# Altium project MSB-PCB-1R2.PrjPcb
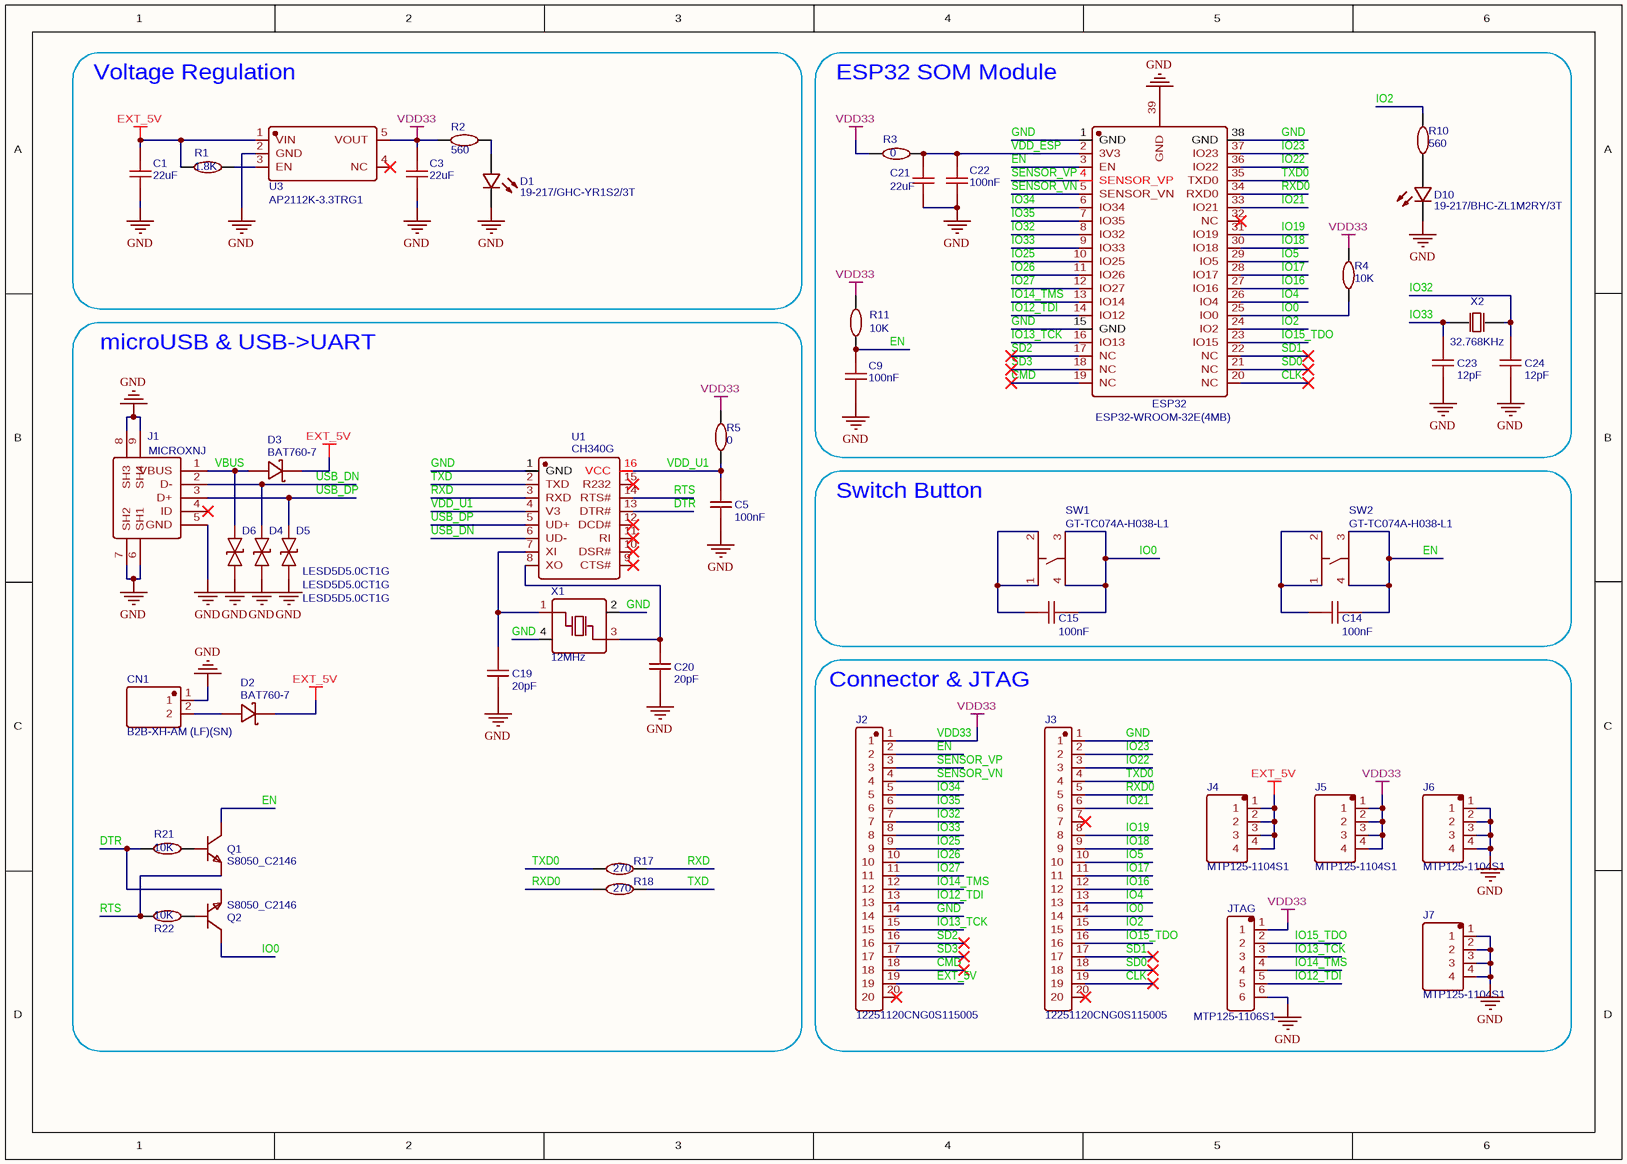
[diagram p0: MSB-PCB-1R2.schdoc]
PRJ_AssemblyVariantStatus: Prototype; PRJ_CompanySiteName: MakerSpace Bonn e.V.; PRJ_DeveloperDate: 15.06.2021; PRJ_DeveloperName: NEK; PRJ_Layouter: NEK; PRJ_PcbNumber: 01; PRJ_PcbVersion: 01; PRJ_SchematicMainTitle: 1rpc ESP32 Baseboard
1 sheet, 48 parts. Net scope: global (net labels, ports and power ports of the same name join across sheets).
Board file: MSB-PCB-1R2.PcbDoc

## Sheet MSB-PCB-1R2.schdoc
size 304 x 217 mm

### Parts
C1  22uF  [C0603]
C3  22uF  [C0603]
C5  100nF  [C0603]
C9  100nF  [C0603]
C14  100nF  [C0603]
C15  100nF  [C0603]
C19  20pF  [C0603]
C20  20pF  [C0603]
C21  22uF  [C0603]
C22  100nF  [C0603]
C23  12pF  [C0603]
C24  12pF  [C0603]
CN1  B2B-XH-AM (LF)(SN)  [CONN-TH_B2B-XH-AM-LF-SN]
D1  19-217/GHC-YR1S2/3T  [LED0603-R-RD]
D2  BAT760-7  [SOD-323_L1.8-W1.3-LS2.5-RD]
D3  BAT760-7  [SOD-323_L1.8-W1.3-LS2.5-RD]
D4  LESD5D5.0CT1G  [SOD-523_L1.2-W0.8-LS1.6-BI]
D5  LESD5D5.0CT1G  [SOD-523_L1.2-W0.8-LS1.6-BI]
D6  LESD5D5.0CT1G  [SOD-523_L1.2-W0.8-LS1.6-BI]
D10  19-217/BHC-ZL1M2RY/3T  [LED0603-R-RD]
ESP32  ESP32-WROOM-32E(4MB)  [WIFI-SMD_ESP32-WROOM-32E]
J1  MICROXNJ  [MICRO-USB-SMD_MICROXNJ]
J2  12251120CNG0S115005  [HDR-TH_19P-P2.54-V]
J3  12251120CNG0S115005  [HDR-TH_19P-P2.54-V]
J4  MTP125-1104S1  [HDR-TH_4P-P2.54-V]
J5  MTP125-1104S1  [HDR-TH_4P-P2.54-V]
J6  MTP125-1104S1  [HDR-TH_4P-P2.54-V]
J7  MTP125-1104S1  [HDR-TH_4P-P2.54-V]
JTAG  MTP125-1106S1  [HDR-TH_6P-P2.54-V]
Q1  S8050_C2146  [SOT-23-3_L3.0-W1.7-P0.95-LS2.9-BR]
Q2  S8050_C2146  [SOT-23-3_L3.0-W1.7-P0.95-LS2.9-BR]
R1  1.8K  [R0603]
R2  560  [R0603]
R3  0  [R0603]
R4  10K  [R0603]
R5  0  [R0603]
R10  560  [R0603]
R11  10K  [R0603]
R17  270  [R0603]
R18  270  [R0603]
R21  10K  [R0603]
R22  10K  [R0603]
SW1  GT-TC074A-H038-L1  [SW-SMD_4P-L4.5-W4.5-P3.00-LS7.0]
SW2  GT-TC074A-H038-L1  [SW-SMD_4P-L4.5-W4.5-P3.00-LS7.0]
U1  CH340G  [SOIC-16_L9.9-W3.9-P1.27-LS6.0-TL]
U3  AP2112K-3.3TRG1  [SOT-25-5_L3.0-W1.8-P0.95-LS3.0-BR]
X1  12MHz  [OSC-SMD_4P-L3.2-W2.5-BL]
X2  32.768KHz  [OSC-SMD_L3.2-W1.5]

### Blocks framed on the sheet
Voltage Regulation: C1 C3 D1 R1 R2 U3
ESP32 SOM Module: C9 C21-C24 D10 ESP32 R3 R4 R10 R11 X2
microUSB & USB->UART: C5 C19 C20 CN1 D2-D6 J1 Q1 Q2 R5 R17 R18 R21 R22 U1 X1
Switch Button: C14 C15 SW1 SW2
Connector & JTAG: J2-J7 JTAG

### Nets
EXT_5V: C1.2 D2.1 D3.1 J2.19 J4.1 J4.2 J4.3 J4.4 R1.1 U3.1(VIN)
GND: C1.1 C3.1 C5.2 C9.1 C19.1 C20.1 C21.1 C22.1 C23.1 C24.1 CN1.1 D1.2(C) D4.1 D5.1 D6.1 D10.2(C) ESP32.1(GND) ESP32.15(GND) ESP32.38(GND) ESP32.39(GND) J1.5(GND) J1.6(SH1) J1.7(SH2) J1.8(SH3) J1.9(SH4) J2.14 J3.1 J6.1 J6.2 J6.3 J6.4 J7.1 J7.2 J7.3 J7.4 JTAG.6 U1.1(GND) U3.2(GND) X1.2(GND) X1.4(GND)
VDD33: C3.2 J2.1 J5.1 J5.2 J5.3 J5.4 JTAG.1 R2.2 R3.1 R4.2 R5.2 R11.2 U3.5(VOUT)
CLK: ESP32.20(NC) J3.19
CMD: ESP32.19(NC) J2.18
DTR: Q2.2(E) R21.1 U1.13(DTR#)
EN: C9.2 C14.2 ESP32.3(EN) J2.2 Q1.3(C) R11.1 SW2.3 SW2.4
IO0: C15.2 ESP32.25(IO0) J3.14 Q2.3(C) R4.1 SW1.3 SW1.4
IO2: ESP32.24(IO2) J3.15 R10.2
IO4: ESP32.26(IO4) J3.13
IO5: ESP32.29(IO5) J3.10
IO12_TDI: ESP32.14(IO12) J2.13 JTAG.5
IO13_TCK: ESP32.16(IO13) J2.15 JTAG.3
IO14_TMS: ESP32.13(IO14) J2.12 JTAG.4
IO15_TDO: ESP32.23(IO15) J3.16 JTAG.2
IO16: ESP32.27(IO16) J3.12
IO17: ESP32.28(IO17) J3.11
IO18: ESP32.30(IO18) J3.9
IO19: ESP32.31(IO19) J3.8
IO21: ESP32.33(IO21) J3.6
IO22: ESP32.36(IO22) J3.3
IO23: ESP32.37(IO23) J3.2
IO25: ESP32.10(IO25) J2.9
IO26: ESP32.11(IO26) J2.10
IO27: ESP32.12(IO27) J2.11
IO32: C24.2 ESP32.8(IO32) J2.7 X2.2(OSC2)
IO33: C23.2 ESP32.9(IO33) J2.8 X2.1(OSC1)
IO34: ESP32.6(IO34) J2.5
IO35: ESP32.7(IO35) J2.6
RTS: Q1.2(E) R22.1 U1.14(RTS#)
RXD: R17.2 U1.3(RXD)
RXD0: ESP32.34(RXD0) J3.5 R18.1
SD0: ESP32.21(NC) J3.18
SD1: ESP32.22(NC) J3.17
SD2: ESP32.17(NC) J2.16
SD3: ESP32.18(NC) J2.17
SENSOR_VN: ESP32.5(SENSOR_VN) J2.4
SENSOR_VP: ESP32.4(SENSOR_VP) J2.3
TXD: R18.2 U1.2(TXD)
TXD0: ESP32.35(TXD0) J3.4 R17.1
USB_DN: D4.2 J1.2(D-) U1.6(UD-)
USB_DP: D5.2 J1.3(D+) U1.5(UD+)
VBUS: D3.2 D6.2 J1.1(VBUS)
VDD_ESP: C21.2 C22.2 ESP32.2(3V3) R3.2
VDD_U1: C5.1 R5.1 U1.4(V3) U1.16(VCC)
NetC14_1: C14.1 SW2.1 SW2.2
NetC15_1: C15.1 SW1.1 SW1.2
NetC19_2: C19.2 U1.7(XI) X1.1(OSC1)
NetC20_2: C20.2 U1.8(XO) X1.3(OSC2)
NetCN1_2: CN1.2 D2.2
NetD1_1: D1.1(A) R2.1
NetD10_1: D10.1(A) R10.1
NetQ1_1: Q1.1(B) R21.2
NetQ2_1: Q2.1(B) R22.2
NetR1_2: R1.2 U3.3(EN)

Not connected (* = marked no-connect by the designer): ESP32 32(NC)*; J1 4(ID)*; J2 20*; J3 7* 20*; U1 9(CTS#)* 10(DSR#)* 11(RI)* 12(DCD#)* 15(R232)*; U3 4(NC)*

### Library data of the parts
C1 C3 C21 = 22uF: BOM_Manufacturer: Murata Electronics; BOM_Manufacturer Part: GRM188R61A226ME15L; nameAlias: Capacitance; Contributor: LCSC; BOM_Supplier: LCSC; BOM_Supplier Part: C167429; BOM_JLCPCB Part Class: Extended Part; spicePre: C; spiceSymbolName: GRM188R61A226ME15L
C5 C9 C14 C15 C22 = 100nF: BOM_Manufacturer: YAGEO; BOM_Manufacturer Part: CC0603KRX7R9BB104; nameAlias: Capacitance; SMT Type: Basic; BOM_Supplier: LCSC; BOM_Supplier Part: C14663; BOM_JLCPCB SMD: Yes; BOM_LCSC Assembly: Yes; spicePre: C; spiceSymbolName: CC0603KRX7R9BB104
C19 C20 = 20pF: BOM_Manufacturer: CCTC; BOM_Manufacturer Part: TCC0603COG200J500CT; nameAlias: Capacitance; Contributor: LCSC; BOM_Supplier: LCSC; BOM_Supplier Part: C376774; spicePre: C; spiceSymbolName: TCC0603COG200J500CT
C23 C24 = 12pF: BOM_Manufacturer: CCTC; BOM_Manufacturer Part: TCC0603COG120J500CT; nameAlias: Capacitance; Contributor: LCSC; BOM_Supplier: LCSC; BOM_Supplier Part: C376767; spicePre: C; spiceSymbolName: TCC0603COG120J500CT
CN1 = B2B-XH-AM (LF)(SN): BOM_Manufacturer: JST Sales America; Contributor: LCSC; BOM_Supplier: LCSC; BOM_Supplier Part: C161869; BOM_Manufacturer Part: -; BOM_JLCPCB Part Class: Extended Part; spicePre: C; spiceSymbolName: B2B-XH-AM (LF)(SN)
D1 = 19-217/GHC-YR1S2/3T: BOM_Manufacturer: EVERLIGHT; BOM_Supplier: LCSC; BOM_Manufacturer Part: 19-217/GHC-YR1S2/3T; BOM_Supplier Part: C72043; BOM_JLCPCB Part Class: Basic Part; spicePre: L; spiceSymbolName: 19-217/GHC-YR1S2/3T
D2 D3 = BAT760-7: BOM_Manufacturer: DIODES; Contributor: LCSC; BOM_Supplier: LCSC; BOM_Manufacturer Part: BAT760-7; BOM_Supplier Part: C124187; BOM_JLCPCB Part Class: Extended Part; spicePre: D; spiceSymbolName: BAT760-7
D4-D6 = LESD5D5.0CT1G: BOM_Manufacturer: Leshan Radio; Contributor: LCSC; BOM_Supplier: LCSC; BOM_Supplier Part: C383211; BOM_Manufacturer Part: LESD5D5.0CT1G; BOM_JLCPCB Part Class: Extended Part; spicePre: D; spiceSymbolName: LESD5D5.0CT1G
D10 = 19-217/BHC-ZL1M2RY/3T: BOM_Manufacturer: EVERLIGHT; BOM_Supplier: LCSC; BOM_Manufacturer Part: 19-217/BHC-ZL1M2RY/3T; BOM_Supplier Part: C72041; BOM_JLCPCB Part Class: Basic Part; spicePre: L; spiceSymbolName: 19-217/BHC-ZL1M2RY/3T
ESP32 = ESP32-WROOM-32E(4MB): BOM_Manufacturer: Espressif Systems; Contributor: LCSC; SMT Type: Extend; BOM_Supplier: LCSC; BOM_Supplier Part: C701341; BOM_Manufacturer Part: ESP32-WROOM-32E(4MB); BOM_LCSC Assembly: Yes; spicePre: U; spiceSymbolName: ESP32-WROOM-32E(4MB)
J1 = MICROXNJ: BOM_Manufacturer: SHOU HAN; Contributor: LCSC; BOM_Supplier: LCSC; BOM_Supplier Part: C404969; BOM_Manufacturer Part: MicroXNJ; spicePre: U; spiceSymbolName: MICROXNJ
J2 J3 = 12251120CNG0S115005: BOM_Manufacturer: JILN; Contributor: LCSC; BOM_Supplier: LCSC; BOM_Supplier Part: C429964; BOM_Manufacturer Part: 12251120CNG0S115005; BOM_JLCPCB Part Class: Extended Part; spicePre: H; spiceSymbolName: 12251120CNG0S115005
J4-J7 = MTP125-1104S1: BOM_Manufacturer: MINTRON; Contributor: LCSC; BOM_Supplier: LCSC; BOM_Supplier Part: C358686; BOM_Manufacturer Part: MTP125-1104S1; BOM_JLCPCB Part Class: Extended Part; spicePre: U; spiceSymbolName: MTP125-1104S1
JTAG = MTP125-1106S1: BOM_Manufacturer: MINTRON; Contributor: LCSC; BOM_Supplier: LCSC; BOM_Supplier Part: C358688; BOM_Manufacturer Part: MTP125-1106S1; BOM_JLCPCB Part Class: Extended Part; spicePre: U; spiceSymbolName: MTP125-1106S1
Q1 Q2 = S8050_C2146: BOM_Manufacturer: CJ; BOM_Manufacturer Part: S8050; SMT Type: Basic; BOM_Supplier: LCSC; image: //image.lceda.cn/szlcsc/C2146.jpg; BOM_Supplier Part: C2146; BOM_JLCPCB SMD: Yes; BOM_LCSC Assembly: Yes; spicePre: Q; spiceSymbolName: S8050_C2146
R1 = 1.8K: BOM_Manufacturer: UniOhm; BOM_Manufacturer Part: 0603WAJ0182T5E; nameAlias: Resistance (Ohms); BOM_Supplier: LCSC; BOM_Supplier Part: C25991; BOM_JLCPCB Part Class: Extended Part; spicePre: R; spiceSymbolName: 0603WAJ0182T5E
R2 R10 = 560: BOM_Manufacturer: UniOhm; BOM_Manufacturer Part: 0603WAF5600T5E; nameAlias: Resistance (Ohms); BOM_Supplier: LCSC; BOM_Supplier Part: C23204; BOM_JLCPCB Part Class: Basic Part; spicePre: R; spiceSymbolName: 0603WAF5600T5E
R3 R5 = 0: BOM_Manufacturer: UniOhm; BOM_Manufacturer Part: 0603WAF0000T5E; nameAlias: Resistance (Ohms); SMT Type: Basic; BOM_Supplier: LCSC; BOM_Supplier Part: C21189; BOM_JLCPCB SMD: Yes; BOM_LCSC Assembly: Yes; spicePre: R; spiceSymbolName: 0603WAF0000T5E
R4 R11 R21 R22 = 10K: BOM_Manufacturer: UniOhm; BOM_Manufacturer Part: 0603WAJ0103T5E; nameAlias: Resistance (Ohms); BOM_Supplier: LCSC; BOM_Supplier Part: C15401; BOM_JLCPCB Part Class: Extended Part; spicePre: R; spiceSymbolName: 0603WAJ0103T5E
R17 R18 = 270: BOM_Manufacturer: UniOhm; BOM_Manufacturer Part: 0603WAJ0271T5E; nameAlias: Resistance (Ohms); BOM_Supplier: LCSC; BOM_Supplier Part: C25223; BOM_JLCPCB Part Class: Extended Part; spicePre: R; spiceSymbolName: 0603WAJ0271T5E
SW1 SW2 = GT-TC074A-H038-L1: BOM_Manufacturer: G-Switch; Contributor: LCSC; BOM_Supplier: LCSC; BOM_Supplier Part: C843603; BOM_Manufacturer Part: GT-TC074A-H038-L1; BOM_JLCPCB Part Class: Extended Part; spicePre: S; spiceSymbolName: GT-TC074A-H038-L1
U1 = CH340G: BOM_Manufacturer: WCH; SMT Type: Basic; timeStamp: 1468327462; BOM_Supplier: LCSC; BOM_Manufacturer Part: CH340G; image: //image.lceda.cn/szlcsc/C14267.jpg; BOM_Supplier Part: C14267; BOM_JLCPCB SMD: Yes; spicePre: U; spiceSymbolName: CH340G
U3 = AP2112K-3.3TRG1: BOM_Manufacturer: DIODES; Contributor: LCSC; SMT Type: Extend; BOM_Supplier: LCSC; BOM_Manufacturer Part: AP2112K-3.3TRG1; BOM_Supplier Part: C51118; BOM_JLCPCB SMD: Yes; spicePre: U; spiceSymbolName: AP2112K-3.3TRG1
X1 = 12MHz: BOM_Manufacturer: YXC; BOM_Manufacturer Part: X322512MSB4SI; nameAlias: Frequency; SMT Type: Basic; BOM_Supplier: LCSC; BOM_Supplier Part: C9002; BOM_JLCPCB SMD: Yes; BOM_LCSC Assembly: Yes; spicePre: X; spiceSymbolName: X322512MSB4SI
X2 = 32.768KHz: BOM_Manufacturer: TKD; BOM_Manufacturer Part: SF32K32768D31T-12.5; nameAlias: Frequency; Contributor: LCSC; BOM_Supplier: LCSC; BOM_Supplier Part: C271654; BOM_JLCPCB Part Class: Extended Part; spicePre: X; spiceSymbolName: SF32K32768D31T-12.5

## Assembly variants
EDI Std Variant: all parts fitted